# Altium schematic sheet Supply_7V.SchDoc
size A; SheetNumber: 8; SheetTotal: 10
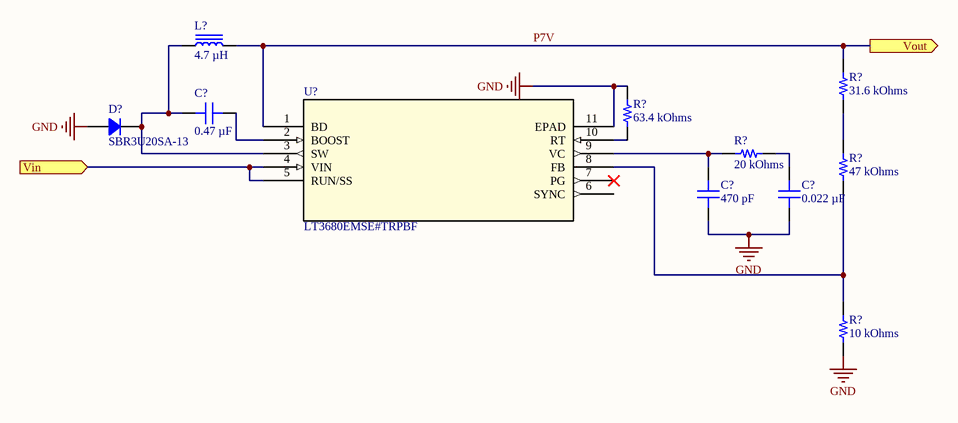
[diagram p0: Supply_7V.SchDoc]

## Parts
(Parts that share a designator on the sheet are numbered #1, #2 ... from top to bottom, then left to right.)
C?#1  0.47 µF  [CAP 0805_2012]
C?#2  470 pF  [CAP 0805_2012]
C?#3  0.022 µF  [CAP 0805_2012]
D?  SBR3U20SA-13  [DO214AC SMA]
L?  4.7 µH  [WURTH WE-HCI 7040]
R?#1  31.6 kOhms  [RES 0805_2012]
R?#2  63.4 kOhms  [RES 0805_2012]
R?#3  20 kOhms  [RES 0805_2012]
R?#4  47 kOhms  [RES 0805_2012]
R?#5  10 kOhms  [RES 0805_2012]
U?  LT3680EMSE#TRPBF  [MSOP-10_MSE_LIT]

## Ports
Vin (in), Vout (out)

## Nets
GND: C?#2.1 C?#3.1 D?.1 R?#2.2 R?#5.1 U?.11(EPAD)
P7V: L?.2 R?#1.2 U?.1(BD) ; port Vout
Vin: U?.4(VIN) U?.5(RUN/SS) ; port Vin
NetC?#1_1: C?#1.1 D?.2 L?.1 U?.3(SW)
NetC?#1_2: C?#1.2 U?.2(BOOST)
NetC?#2_2: C?#2.2 R?#3.1 U?.9(VC)
NetC?#3_2: C?#3.2 R?#3.2
NetR?#1_1: R?#1.1 R?#4.2
NetR?#2_1: R?#2.1 U?.10(RT)
NetR?#4_1: R?#4.1 R?#5.2 U?.8(FB)

Not connected (* = marked no-connect by the designer): U? 6(SYNC) 7(PG)*

## Library data of the parts
C?#1 = C0805C474K5RACAUTO7210: CAP CER 0.47UF 50V X7R 0805; manufacturer: KEMET; Tolerance: ±10%; Part Number: C0805C474K5RACAUTO7210; Value: 0.47 µF; Applications: Automotive, Bypass, Decoupling; Capacitance: 0.47 µF; componentlink1description: Datasheet; componentlink1url: https://connect.kemet.com:7667/gateway/IntelliData-ComponentDocumentation/1.0/download/datasheet/C0805C474K5RACAUTO7210; componentlink2description: DigiKey Link; componentlink2url: https://www.digikey.com/en/products/detail/kemet/C0805C474K5RACAUTO7210/11673924; Device Package: 0805 (2012 Metric); lastupdated: 6/3/2023 7:15:48 PM; Lifecycle Status: Active; Minimum Order: 1; Mounting Type: Surface Mount, MLCC; Operating Temperature: -55°C ~ 125°C; Package / Case: 0805 (2012 Metric); packaging: TapeAndReel; partid: 50121; Part Status: Active; price: 0.05; Ratings: AEC-Q200; series: SMD Auto X7R; Size / Dimension: 0.079" L x 0.049" W (2.00mm x 1.25mm); Supplier 1: DigiKey; Supplier Part Number 1: 399-C0805C474K5RACAUTO7210CT-ND; Temperature Coefficient: X7R; Thickness (Max): 0.043" (1.10mm); Voltage - Rated: 50V
C?#2 = C0805S471K5RACAUTO: CAP CER 470PF 50V X7R 0805; manufacturer: KEMET; Tolerance: ±10%; Part Number: C0805S471K5RACAUTO; Value: 470 pF; Applications: Automotive; Capacitance: 470 pF; componentlink1description: Datasheet; componentlink1url: https://api.kemet.com/component-edge/download/datasheet/C0805S471K5RACAUTO.pdf; componentlink2description: DigiKey Link; componentlink2url: https://www.digikey.com/en/products/detail/kemet/C0805S471K5RACAUTO/9742175; Device Package: 0805 (2012 Metric); Features: Floating Electrode; lastupdated: 6/3/2023 7:17:29 PM; Lifecycle Status: Active; Minimum Order: 1; Mounting Type: Surface Mount, MLCC; Operating Temperature: -55°C ~ 125°C; Package / Case: 0805 (2012 Metric); packaging: TapeAndReel; partid: 2648; Part Status: Active; price: 0.05; Ratings: AEC-Q200; series: SMD Auto X7R FE; Size / Dimension: 0.079" L x 0.049" W (2.00mm x 1.25mm); Supplier 1: DigiKey; Supplier Part Number 1: 399-19424-1-ND; Temperature Coefficient: X7R; Thickness (Max): 0.035" (0.88mm); Voltage - Rated: 50V
C?#3 = C0805C223K5RACAUTO: CAP CER 0.022UF 50V X7R 0805; manufacturer: KEMET; Tolerance: ±10%; Part Number: C0805C223K5RACAUTO; Value: 0.022 µF; Applications: Automotive, Bypass, Decoupling; Capacitance: 0.022 µF; componentlink1description: Datasheet; componentlink1url: https://api.kemet.com/component-edge/download/datasheet/C0805C223K5RACAUTO.pdf; componentlink2description: DigiKey Link; componentlink2url: https://www.digikey.com/en/products/detail/kemet/C0805C223K5RACAUTO/3314937; Device Package: 0805 (2012 Metric); lastupdated: 6/3/2023 7:17:25 PM; Lifecycle Status: Active; Minimum Order: 1; Mounting Type: Surface Mount, MLCC; Operating Temperature: -55°C ~ 125°C; Package / Case: 0805 (2012 Metric); packaging: TapeAndReel; partid: 4413; Part Status: Active; price: 0.01; Ratings: AEC-Q200; series: SMD Auto X7R; Size / Dimension: 0.079" L x 0.049" W (2.00mm x 1.25mm); Supplier 1: DigiKey; Supplier Part Number 1: 399-6945-1-ND; Temperature Coefficient: X7R; Thickness (Max): 0.035" (0.88mm); Voltage - Rated: 50V
D? = SBR3U20SA-13: DIODE SBR 20V 3A SMA; Manufacturer: Diodes Incorporated; Current - Reverse Leakage @ Vr: 500 µA @ 20 V; Diode Type: Super Barrier; Speed: Fast Recovery =< 500ns, > 200mA (Io); Voltage - Forward (Vf) (Max) @ If: 390 mV @ 3 A; Part Number: SBR3U20SA-13; ComponentLink1Description: Datasheet; ComponentLink1URL: https://www.diodes.com/assets/Datasheets/SBR3U20SA.pdf; ComponentLink2Description: DigiKey Link; ComponentLink2URL: https://www.digikey.com/en/products/detail/diodes-incorporated/SBR3U20SA-13/1935403; Current - Average Rectified (Io): 3A; LastUpdated: 6/3/2023 8:19:40 PM; Lifecycle Status: Active; Minimum Order: 1; Mounting Type: Surface Mount; Operating Temperature - Junction: -65°C ~ 150°C; Package / Case: DO-214AC, SMA; Packaging: TapeAndReel; PartId: 2122; Part Status: Active; Price: 0.19; Series: SBR®; Supplier 1: DigiKey; Supplier Part Number 1: SBR3U20SA-13DICT-ND; Supplier Device Package: SMA; Voltage - DC Reverse (Vr) (Max): 20 V
L? = 744311470: FIXED IND 4.7UH 6A 19.5 MOHM SMD; Manufacturer: Würth Elektronik; Current - Saturation: 7A; Frequency - Self Resonant: 33MHz; Inductance Frequency - Test: 100 kHz; Material - Core: Nonstandard; Shielding: Shielded; Tolerance: ±20%; Type: Wirewound; Part Number: 744311470; ComponentLink1Description: Datasheet; ComponentLink1URL: https://katalog.we-online.de/pbs/datasheet/744311470.pdf; ComponentLink2Description: DigiKey Link; ComponentLink2URL: https://www.digikey.com/en/products/detail/würth-elektronik/744311470/1638558; Current Rating (Amps): 6 A; DC Resistance (DCR): 19.5mOhm; Device Package: Nonstandard; Height - Seated (Max): 0.157" (4.00mm); Inductance: 4.7 µH; LastUpdated: 6/3/2023 8:33:14 PM; Lifecycle Status: Active; Minimum Order: 1; Mounting Type: Surface Mount; Operating Temperature: -40°C ~ 150°C; Package / Case: Nonstandard; Packaging: TapeAndReel; PartId: 258; Part Status: Active; Price: 2.72; Ratings: AEC-Q200; Series: WE-HCI; Size / Dimension: 0.276" L x 0.272" W (7.00mm x 6.90mm); Supplier 1: DigiKey; Supplier Part Number 1: 732-1153-1-ND; Supplier Device Package: 7040; Value: 4.7 µH
R?#1 = ERA-6AEB3162V: RES 31.6K OHM 0.1% 1/8W 0805; Manufacturer: Panasonic Electronic Components; Power (Watts): 0.125W, 1/8W; Temperature Coefficient: ±25ppm/°C; Part Number: ERA-6AEB3162V; Value: 31.6 kOhms; ComponentLink1Description: Datasheet; ComponentLink1URL: https://industrial.panasonic.com/cdbs/www-data/pdf/RDM0000/AOA0000C307.pdf; ComponentLink2Description: DigiKey Link; ComponentLink2URL: https://www.digikey.com/en/products/detail/panasonic-electronic-components/ERA-6AEB3162V/2025797; Composition: Thin Film; Device Package: 0805 (2012 Metric); Features: Automotive AEC-Q200; Height - Seated (Max): 0.024" (0.60mm); LastUpdated: 6/3/2023 7:56:09 PM; Lifecycle Status: Active; Minimum Order: 1; Number of Terminations: 2; Operating Temperature: -55°C ~ 155°C; Package / Case: 0805 (2012 Metric); Packaging: TapeAndReel; PartId: 48900; Part Status: Active; Price: 0.03; Ratings: AEC-Q200; Resistance: 31.6 kOhms; Series: ERA-6A; Size / Dimension: 0.079" L x 0.049" W (2.00mm x 1.25mm); Supplier 1: DigiKey; Supplier Part Number 1: P31.6KDACT-ND; Supplier Device Package: 0805; Tolerance: ±0.1%
R?#2 = KTR10EZPF6342: RES SMD 63.4K OHM 1% 1/8W 0805; Manufacturer: Rohm Semiconductor; Power (Watts): 0.125W, 1/8W; Temperature Coefficient: ±100ppm/°C; Part Number: KTR10EZPF6342; Value: 63.4 kOhms; ComponentLink1Description: Datasheet; ComponentLink1URL: https://www.rohm.com/datasheet/KTR03EZPF/ktr-e; ComponentLink2Description: DigiKey Link; ComponentLink2URL: https://www.digikey.com/en/products/detail/rohm-semiconductor/KTR10EZPF6342/4052136; Composition: Thick Film; Device Package: 0805 (2012 Metric); Features: Automotive AEC-Q200, High Voltage; Height - Seated (Max): 0.026" (0.65mm); LastUpdated: 6/3/2023 7:57:41 PM; Lifecycle Status: Active; Minimum Order: 1; Number of Terminations: 2; Operating Temperature: -55°C ~ 155°C; Package / Case: 0805 (2012 Metric); Packaging: TapeAndReel; PartId: 29149; Part Status: Active; Price: 0.02; Ratings: AEC-Q200; Resistance: 63.4 kOhms; Series: KTR; Size / Dimension: 0.079" L x 0.049" W (2.00mm x 1.25mm); Supplier 1: DigiKey; Supplier Part Number 1: RHM63.4KAHCT-ND; Supplier Device Package: 0805; Tolerance: ±1%
R?#3 = CRCW080520K0FKEAHP: RES SMD 20K OHM 1% 1/2W 0805; Manufacturer: Vishay Dale; Power (Watts): 0.5W, 1/2W; Temperature Coefficient: ±100ppm/°C; Part Number: CRCW080520K0FKEAHP; Value: 20 kOhms; ComponentLink1Description: Datasheet; ComponentLink1URL: http://www.vishay.com/docs/20043/crcwhpe3.pdf; ComponentLink2Description: DigiKey Link; ComponentLink2URL: https://www.digikey.com/en/products/detail/vishay-dale/CRCW080520K0FKEAHP/2222356; Composition: Thick Film; Device Package: 0805 (2012 Metric); Features: Automotive AEC-Q200, Pulse Withstanding; Height - Seated (Max): 0.020" (0.50mm); LastUpdated: 6/3/2023 7:57:38 PM; Lifecycle Status: Active; Minimum Order: 1; Number of Terminations: 2; Operating Temperature: -55°C ~ 155°C; Package / Case: 0805 (2012 Metric); Packaging: TapeAndReel; PartId: 30339; Part Status: Active; Price: 0.02; Ratings: AEC-Q200; Resistance: 20 kOhms; Series: CRCW-HP; Size / Dimension: 0.079" L x 0.049" W (2.00mm x 1.25mm); Supplier 1: DigiKey; Supplier Part Number 1: 541-20.0KTCT-ND; Supplier Device Package: 0805; Tolerance: ±1%
R?#4 = ERA-6AEB473V: RES 47K OHM 0.1% 1/8W 0805; Manufacturer: Panasonic Electronic Components; Power (Watts): 0.125W, 1/8W; Temperature Coefficient: ±25ppm/°C; Part Number: ERA-6AEB473V; Value: 47 kOhms; ComponentLink1Description: Datasheet; ComponentLink1URL: https://industrial.panasonic.com/cdbs/www-data/pdf/RDM0000/AOA0000C307.pdf; ComponentLink2Description: DigiKey Link; ComponentLink2URL: https://www.digikey.com/en/products/detail/panasonic-electronic-components/ERA-6AEB473V/1465789; Composition: Thin Film; Device Package: 0805 (2012 Metric); Features: Automotive AEC-Q200; Height - Seated (Max): 0.024" (0.60mm); LastUpdated: 6/3/2023 7:57:45 PM; Lifecycle Status: Active; Minimum Order: 1; Number of Terminations: 2; Operating Temperature: -55°C ~ 155°C; Package / Case: 0805 (2012 Metric); Packaging: TapeAndReel; PartId: 28071; Part Status: Active; Price: 0.03; Ratings: AEC-Q200; Resistance: 47 kOhms; Series: ERA-6A; Size / Dimension: 0.079" L x 0.049" W (2.00mm x 1.25mm); Supplier 1: DigiKey; Supplier Part Number 1: P47KDACT-ND; Supplier Device Package: 0805; Tolerance: ±0.1%
R?#5 = ERA-6AEB103V: RES 10K OHM 0.1% 1/8W 0805; Manufacturer: Panasonic Electronic Components; Power (Watts): 0.125W, 1/8W; Temperature Coefficient: ±25ppm/°C; Part Number: ERA-6AEB103V; Value: 10 kOhms; ComponentLink1Description: Datasheet; ComponentLink1URL: https://industrial.panasonic.com/cdbs/www-data/pdf/RDM0000/AOA0000C307.pdf; ComponentLink2Description: DigiKey Link; ComponentLink2URL: https://www.digikey.com/en/products/detail/panasonic-electronic-components/ERA-6AEB103V/1465773; Composition: Thin Film; Device Package: 0805 (2012 Metric); Features: Automotive AEC-Q200; Height - Seated (Max): 0.024" (0.60mm); LastUpdated: 6/3/2023 7:57:45 PM; Lifecycle Status: Active; Minimum Order: 1; Number of Terminations: 2; Operating Temperature: -55°C ~ 155°C; Package / Case: 0805 (2012 Metric); Packaging: TapeAndReel; PartId: 28062; Part Status: Active; Price: 0.04; Ratings: AEC-Q200; Resistance: 10 kOhms; Series: ERA-6A; Size / Dimension: 0.079" L x 0.049" W (2.00mm x 1.25mm); Supplier 1: DigiKey; Supplier Part Number 1: P10KDACT-ND; Supplier Device Package: 0805; Tolerance: ±0.1%
U? = LT3680EMSE#TRPBF: No Description Available; Mfr_Name: Analog Devices Inc; RefDes: RefDes; Type: Type